# EAGLE design base_station (EAGLE 6.5.0)
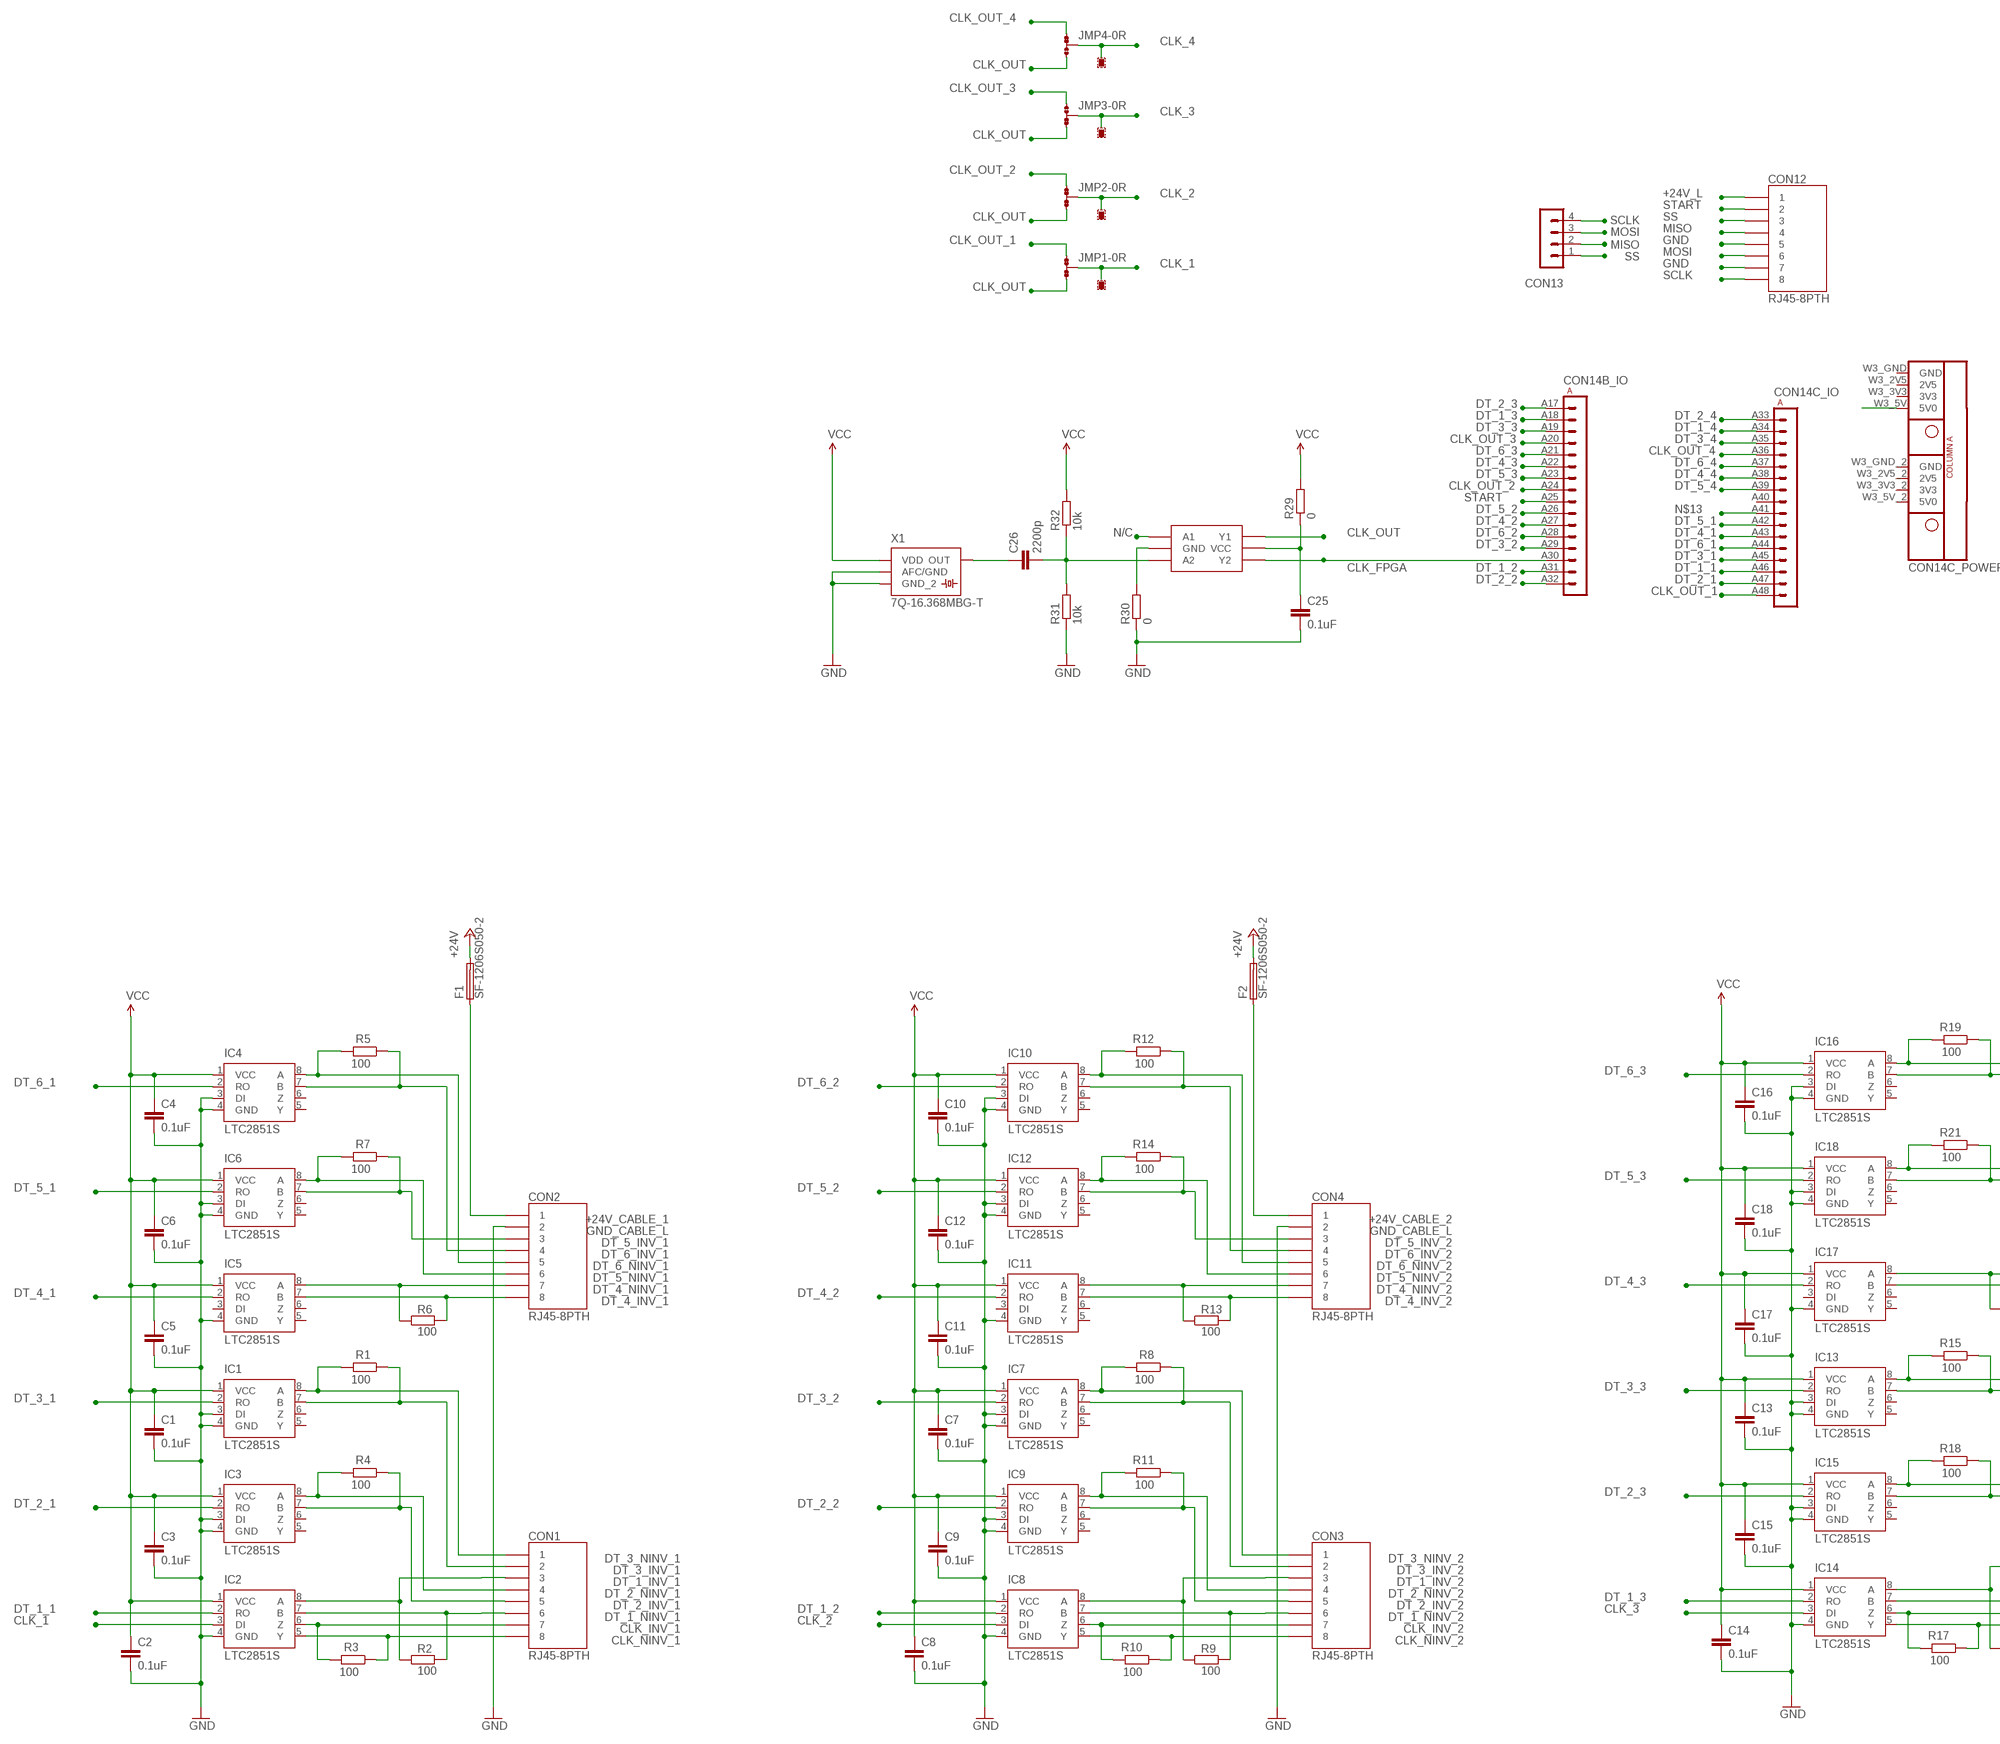
[diagram p0: schematic, sheet 1, part 1 of 2]
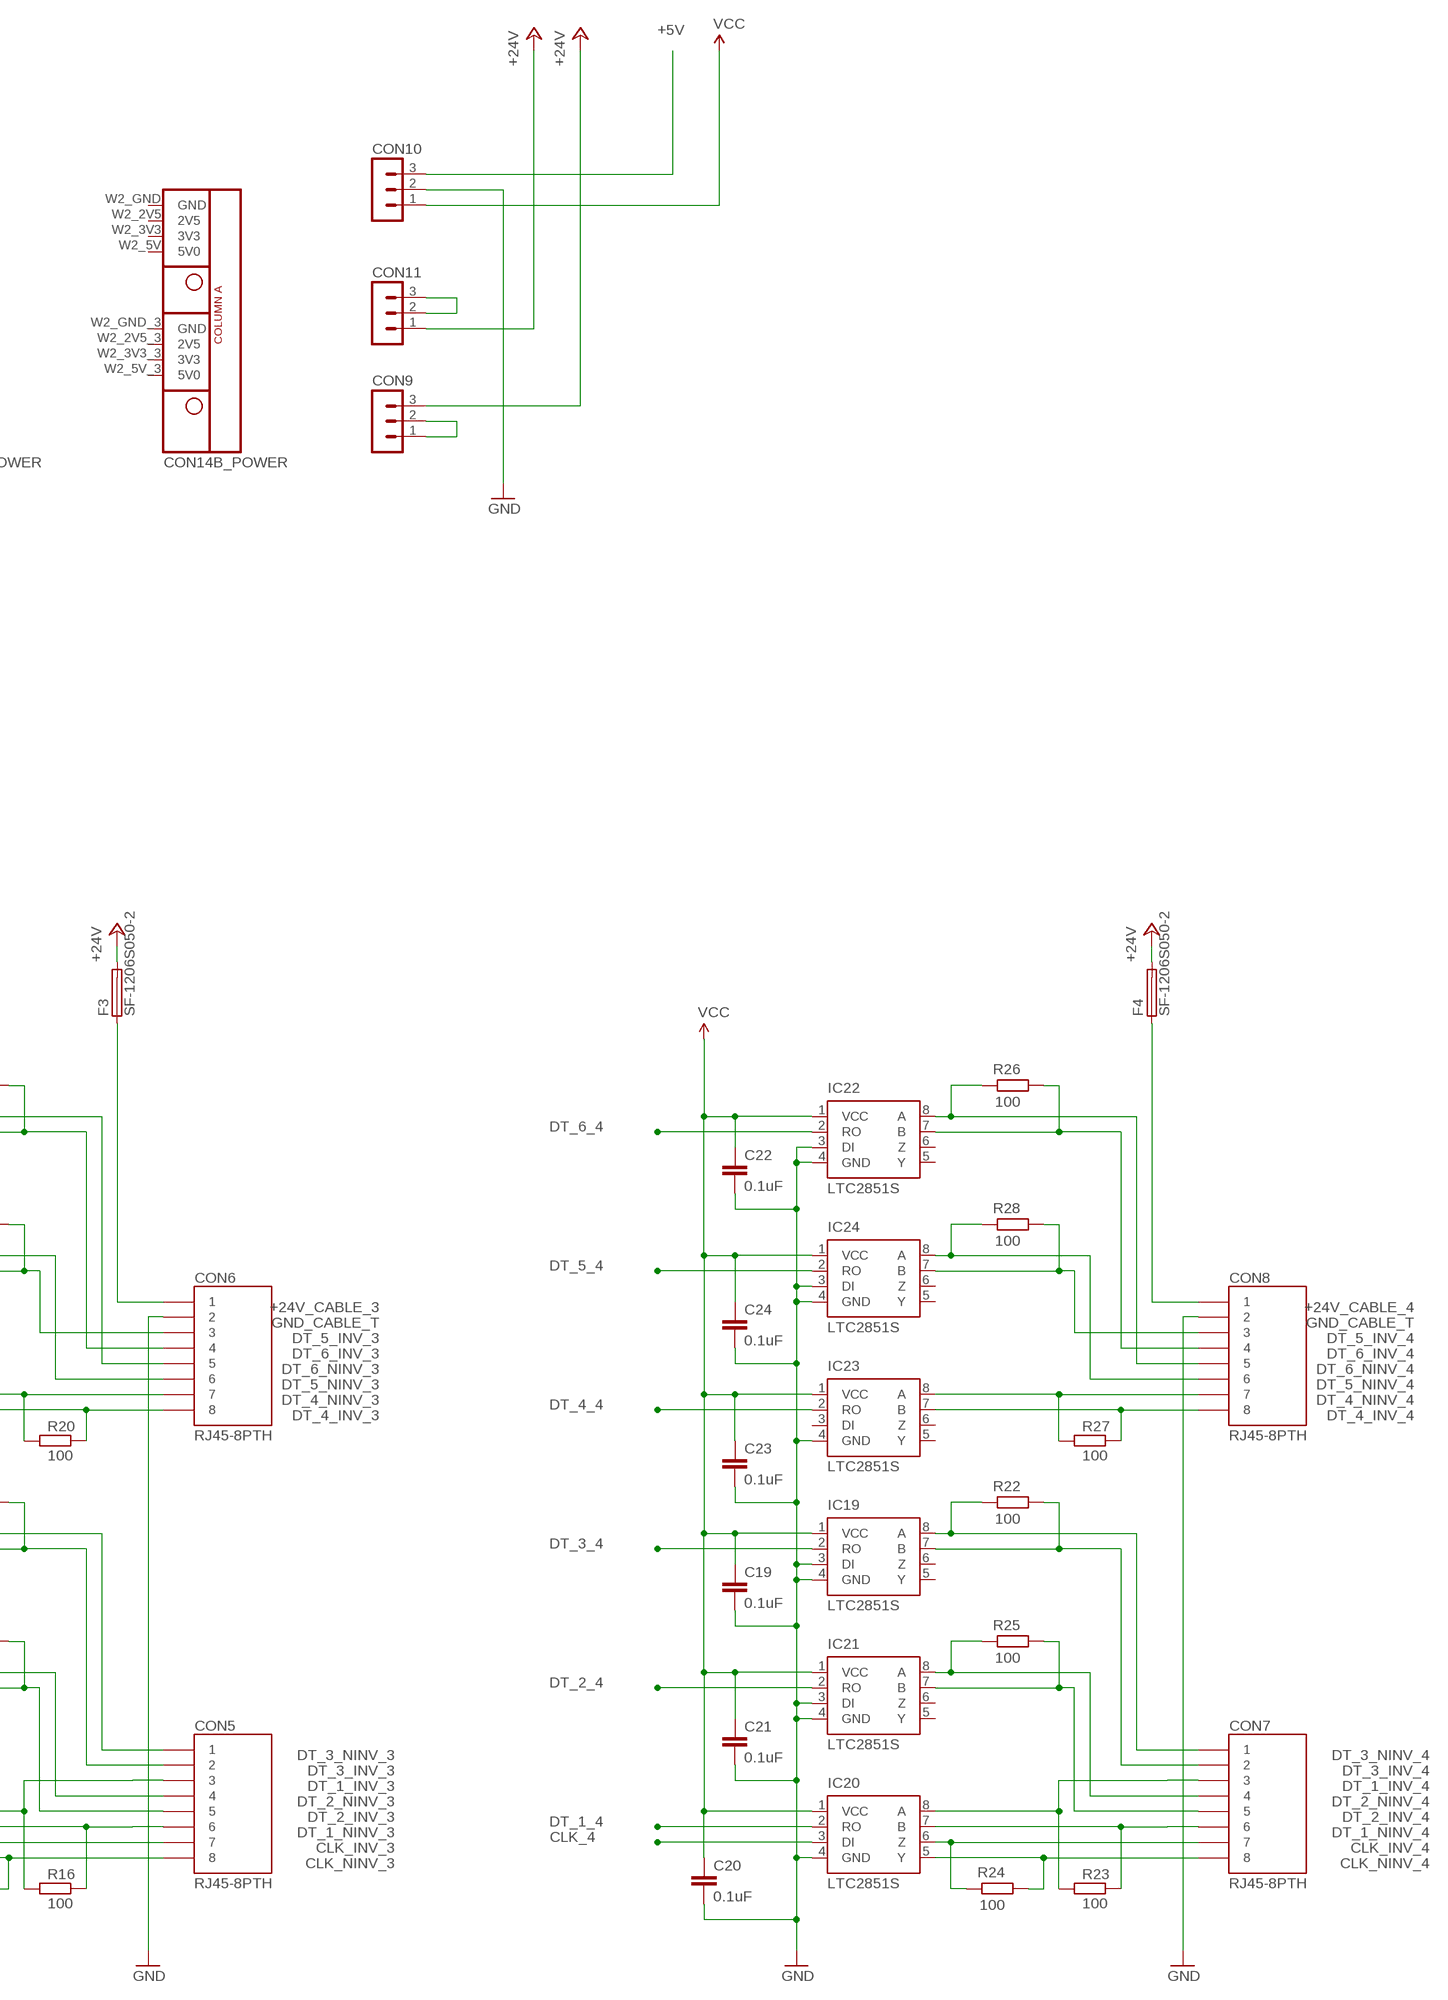
[diagram p1: schematic, sheet 1, part 2 of 2]

## Parts
C1  0.1uF  C-EUC0603  [C0603]
C2  0.1uF  C-EUC0603  [C0603]
C3  0.1uF  C-EUC0603  [C0603]
C4  0.1uF  C-EUC0603  [C0603]
C5  0.1uF  C-EUC0603  [C0603]
C6  0.1uF  C-EUC0603  [C0603]
C7  0.1uF  C-EUC0603  [C0603]
C8  0.1uF  C-EUC0603  [C0603]
C9  0.1uF  C-EUC0603  [C0603]
C10  0.1uF  C-EUC0603  [C0603]
C11  0.1uF  C-EUC0603  [C0603]
C12  0.1uF  C-EUC0603  [C0603]
C13  0.1uF  C-EUC0603  [C0603]
C14  0.1uF  C-EUC0603  [C0603]
C15  0.1uF  C-EUC0603  [C0603]
C16  0.1uF  C-EUC0603  [C0603]
C17  0.1uF  C-EUC0603  [C0603]
C18  0.1uF  C-EUC0603  [C0603]
C19  0.1uF  C-EUC0603  [C0603]
C20  0.1uF  C-EUC0603  [C0603]
C21  0.1uF  C-EUC0603  [C0603]
C22  0.1uF  C-EUC0603  [C0603]
C23  0.1uF  C-EUC0603  [C0603]
C24  0.1uF  C-EUC0603  [C0603]
C25  0.1uF  C-EUC0603  [C0603]
C26  2200p  C-EUC0603  [C0603]
CON1  RJ45-8PTH  [RJ45-8]
CON2  RJ45-8PTH  [RJ45-8]
CON3  RJ45-8PTH  [RJ45-8]
CON4  RJ45-8PTH  [RJ45-8]
CON5  RJ45-8PTH  [RJ45-8]
CON6  RJ45-8PTH  [RJ45-8]
CON7  RJ45-8PTH  [RJ45-8]
CON8  RJ45-8PTH  [RJ45-8]
CON9  MA03-1  [MA03-1]
CON10  MA03-1  [MA03-1]
CON11  MA03-1  [MA03-1]
CON12  RJ45-8PTH  [RJ45-8]
CON13  WING4  [WINGSIDE_4BIT]
CON14  MEGAWING_HALF_P1  [MEGAWING_HALF_NOHOLES_P1]
F1  SF-1206S050-2  [F1206]
F2  SF-1206S050-2  [F1206]
F3  SF-1206S050-2  [F1206]
F4  SF-1206S050-2  [F1206]
IC1  LTC2851S  [SOIC8]
IC2  LTC2851S  [SOIC8]
IC3  LTC2851S  [SOIC8]
IC4  LTC2851S  [SOIC8]
IC5  LTC2851S  [SOIC8]
IC6  LTC2851S  [SOIC8]
IC7  LTC2851S  [SOIC8]
IC8  LTC2851S  [SOIC8]
IC9  LTC2851S  [SOIC8]
IC10  LTC2851S  [SOIC8]
IC11  LTC2851S  [SOIC8]
IC12  LTC2851S  [SOIC8]
IC13  LTC2851S  [SOIC8]
IC14  LTC2851S  [SOIC8]
IC15  LTC2851S  [SOIC8]
IC16  LTC2851S  [SOIC8]
IC17  LTC2851S  [SOIC8]
IC18  LTC2851S  [SOIC8]
IC19  LTC2851S  [SOIC8]
IC20  LTC2851S  [SOIC8]
IC21  LTC2851S  [SOIC8]
IC22  LTC2851S  [SOIC8]
IC23  LTC2851S  [SOIC8]
IC24  LTC2851S  [SOIC8]
IC26  NC7WZ16P6X  [NC7WZ16P6X]
JMP1  0R-JUMPA  [A0R-JMP]
JMP2  0R-JUMPA  [A0R-JMP]
JMP3  0R-JUMPA  [A0R-JMP]
JMP4  0R-JUMPA  [A0R-JMP]
R1  100  R-EU_R0603  [R0603]
R2  100  R-EU_R0603  [R0603]
R3  100  R-EU_R0603  [R0603]
R4  100  R-EU_R0603  [R0603]
R5  100  R-EU_R0603  [R0603]
R6  100  R-EU_R0603  [R0603]
R7  100  R-EU_R0603  [R0603]
R8  100  R-EU_R0603  [R0603]
R9  100  R-EU_R0603  [R0603]
R10  100  R-EU_R0603  [R0603]
R11  100  R-EU_R0603  [R0603]
R12  100  R-EU_R0603  [R0603]
R13  100  R-EU_R0603  [R0603]
R14  100  R-EU_R0603  [R0603]
R15  100  R-EU_R0603  [R0603]
R16  100  R-EU_R0603  [R0603]
R17  100  R-EU_R0603  [R0603]
R18  100  R-EU_R0603  [R0603]
R19  100  R-EU_R0603  [R0603]
R20  100  R-EU_R0603  [R0603]
R21  100  R-EU_R0603  [R0603]
R22  100  R-EU_R0603  [R0603]
R23  100  R-EU_R0603  [R0603]
R24  100  R-EU_R0603  [R0603]
R25  100  R-EU_R0603  [R0603]
R26  100  R-EU_R0603  [R0603]
R27  100  R-EU_R0603  [R0603]
R28  100  R-EU_R0603  [R0603]
R29  0  R-EU_R0603  [R0603]
R30  0  R-EU_R0603  [R0603]
R31  10k  R-EU_R0603  [R0603]
R32  10k  R-EU_R0603  [R0603]
X1  7Q-16.368MBG-T  [4-SMD]

## Nets
+5V: CON10.3 CON14.W3_5V(C_POWER:5V0)
+24V_CABLE_1: CON2.1 F1.1
+24V_CABLE_2: CON4.1 F2.1
+24V_CABLE_3: CON6.1 F3.1
+24V_CABLE_4: CON8.1 F4.1
+24V_L: CON9.3 CON12.1 F1.2 F2.2 ; supply symbol labelled +24V
+24V_T: CON11.1 F3.2 F4.2 ; supply symbol labelled +24V
CLK_1: IC2.3(DI) JMP1.2
CLK_2: IC8.3(DI) JMP2.2
CLK_3: IC14.3(DI) JMP3.2
CLK_4: IC20.3(DI) JMP4.2
CLK_FPGA: CON14.A30(B_IO:A14) IC26.P$4(Y2)
CLK_INV_1: CON1.7 IC2.6(Z) R3.2
CLK_INV_2: CON3.7 IC8.6(Z) R10.2
CLK_INV_3: CON5.7 IC14.6(Z) R17.2
CLK_INV_4: CON7.7 IC20.6(Z) R24.2
CLK_NINV_1: CON1.8 IC2.5(Y) R3.1
CLK_NINV_2: CON3.8 IC8.5(Y) R10.1
CLK_NINV_3: CON5.8 IC14.5(Y) R17.1
CLK_NINV_4: CON7.8 IC20.5(Y) R24.1
CLK_OUT: IC26.P$6(Y1) JMP1.3 JMP2.3 JMP3.3 JMP4.3
CLK_OUT_1: CON14.A48(C_IO:A16) JMP1.1
CLK_OUT_2: CON14.A24(B_IO:A8) JMP2.1
CLK_OUT_3: CON14.A20(B_IO:A4) JMP3.1
CLK_OUT_4: CON14.A36(C_IO:A4) JMP4.1
DT_1_1: CON14.A46(C_IO:A14) IC2.2(RO)
DT_1_2: CON14.A31(B_IO:A15) IC8.2(RO)
DT_1_3: CON14.A18(B_IO:A2) IC14.2(RO)
DT_1_4: CON14.A34(C_IO:A2) IC20.2(RO)
DT_1_INV_1: CON1.3 IC2.8(A) R2.1
DT_1_INV_2: CON3.3 IC8.8(A) R9.1
DT_1_INV_3: CON5.3 IC14.8(A) R16.1
DT_1_INV_4: CON7.3 IC20.8(A) R23.1
DT_1_NINV_1: CON1.6 IC2.7(B) R2.2
DT_1_NINV_2: CON3.6 IC8.7(B) R9.2
DT_1_NINV_3: CON5.6 IC14.7(B) R16.2
DT_1_NINV_4: CON7.6 IC20.7(B) R23.2
DT_2_1: CON14.A47(C_IO:A15) IC3.2(RO)
DT_2_2: CON14.A32(B_IO:A16) IC9.2(RO)
DT_2_3: CON14.A17(B_IO:A1) IC15.2(RO)
DT_2_4: CON14.A33(C_IO:A1) IC21.2(RO)
DT_2_INV_1: CON1.5 IC3.7(B) R4.1
DT_2_INV_2: CON3.5 IC9.7(B) R11.1
DT_2_INV_3: CON5.5 IC15.7(B) R18.1
DT_2_INV_4: CON7.5 IC21.7(B) R25.1
DT_2_NINV_1: CON1.4 IC3.8(A) R4.2
DT_2_NINV_2: CON3.4 IC9.8(A) R11.2
DT_2_NINV_3: CON5.4 IC15.8(A) R18.2
DT_2_NINV_4: CON7.4 IC21.8(A) R25.2
DT_3_1: CON14.A45(C_IO:A13) IC1.2(RO)
DT_3_2: CON14.A29(B_IO:A13) IC7.2(RO)
DT_3_3: CON14.A19(B_IO:A3) IC13.2(RO)
DT_3_4: CON14.A35(C_IO:A3) IC19.2(RO)
DT_3_INV_1: CON1.2 IC1.7(B) R1.1
DT_3_INV_2: CON3.2 IC7.7(B) R8.1
DT_3_INV_3: CON5.2 IC13.7(B) R15.1
DT_3_INV_4: CON7.2 IC19.7(B) R22.1
DT_3_NINV_1: CON1.1 IC1.8(A) R1.2
DT_3_NINV_2: CON3.1 IC7.8(A) R8.2
DT_3_NINV_3: CON5.1 IC13.8(A) R15.2
DT_3_NINV_4: CON7.1 IC19.8(A) R22.2
DT_4_1: CON14.A43(C_IO:A11) IC5.2(RO)
DT_4_2: CON14.A27(B_IO:A11) IC11.2(RO)
DT_4_3: CON14.A22(B_IO:A6) IC17.2(RO)
DT_4_4: CON14.A38(C_IO:A6) IC23.2(RO)
DT_4_INV_1: CON2.8 IC5.7(B) R6.2
DT_4_INV_2: CON4.8 IC11.7(B) R13.2
DT_4_INV_3: CON6.8 IC17.7(B) R20.2
DT_4_INV_4: CON8.8 IC23.7(B) R27.2
DT_4_NINV_1: CON2.7 IC5.8(A) R6.1
DT_4_NINV_2: CON4.7 IC11.8(A) R13.1
DT_4_NINV_3: CON6.7 IC17.8(A) R20.1
DT_4_NINV_4: CON8.7 IC23.8(A) R27.1
DT_5_1: CON14.A42(C_IO:A10) IC6.2(RO)
DT_5_2: CON14.A26(B_IO:A10) IC12.2(RO)
DT_5_3: CON14.A23(B_IO:A7) IC18.2(RO)
DT_5_4: CON14.A39(C_IO:A7) IC24.2(RO)
DT_5_INV_1: CON2.3 IC6.7(B) R7.1
DT_5_INV_2: CON4.3 IC12.7(B) R14.1
DT_5_INV_3: CON6.3 IC18.7(B) R21.1
DT_5_INV_4: CON8.3 IC24.7(B) R28.1
DT_5_NINV_1: CON2.6 IC6.8(A) R7.2
DT_5_NINV_2: CON4.6 IC12.8(A) R14.2
DT_5_NINV_3: CON6.6 IC18.8(A) R21.2
DT_5_NINV_4: CON8.6 IC24.8(A) R28.2
DT_6_1: CON14.A44(C_IO:A12) IC4.2(RO)
DT_6_2: CON14.A28(B_IO:A12) IC10.2(RO)
DT_6_3: CON14.A21(B_IO:A5) IC16.2(RO)
DT_6_4: CON14.A37(C_IO:A5) IC22.2(RO)
DT_6_INV_1: CON2.4 IC4.7(B) R5.1
DT_6_INV_2: CON4.4 IC10.7(B) R12.1
DT_6_INV_3: CON6.4 IC16.7(B) R19.1
DT_6_INV_4: CON8.4 IC22.7(B) R26.1
DT_6_NINV_1: CON2.5 IC4.8(A) R5.2
DT_6_NINV_2: CON4.5 IC10.8(A) R12.2
DT_6_NINV_3: CON6.5 IC16.8(A) R19.2
DT_6_NINV_4: CON8.5 IC22.8(A) R26.2
GND: C1.2 C2.2 C3.2 C4.2 C5.2 C6.2 C7.2 C8.2 C9.2 C10.2 C11.2 C12.2 C13.2 C14.2 C15.2 C16.2 C17.2 C18.2 C19.2 C20.2 C21.2 C22.2 C23.2 C24.2 C25.2 CON10.2 CON12.5 CON12.7 IC1.3(DI) IC1.4(GND) IC2.4(GND) IC3.3(DI) IC3.4(GND) IC4.3(DI) IC4.4(GND) IC5.4(GND) IC6.3(DI) IC6.4(GND) IC7.3(DI) IC7.4(GND) IC8.4(GND) IC9.3(DI) IC9.4(GND) IC10.3(DI) IC10.4(GND) IC11.4(GND) IC12.3(DI) IC12.4(GND) IC13.3(DI) IC13.4(GND) IC14.4(GND) IC15.3(DI) IC15.4(GND) IC16.3(DI) IC16.4(GND) IC17.4(GND) IC18.3(DI) IC18.4(GND) IC19.3(DI) IC19.4(GND) IC20.4(GND) IC21.3(DI) IC21.4(GND) IC22.3(DI) IC22.4(GND) IC23.4(GND) IC24.3(DI) IC24.4(GND) R30.1 R31.1 X1.PAD_1(AFC/GND) X1.PAD_2(GND_2)
GND_CABLE_L: CON2.2 CON4.2 CON9.1 CON9.2 ; supply symbol labelled GND
GND_CABLE_T: CON6.2 CON8.2 CON11.2 CON11.3 ; supply symbol labelled GND
MISO: CON12.4 CON13.2(A2)
MOSI: CON12.6 CON13.3(A3)
N$4: IC26.P$2(GND) R30.2
N$5: C25.1 IC26.P$5(VCC) R29.1
N$6: C26.2 IC26.P$3(A2) R31.2 R32.1
N$9: C26.1 X1.PAD_3(OUT)
N$13: CON14.A41(C_IO:A9)
N/C: IC26.P$1(A1)
SCLK: CON12.8 CON13.4(A4)
SS: CON12.3 CON13.1(A1)
START: CON12.2 CON14.A25(B_IO:A9)
VCC: C1.1 C2.1 C3.1 C4.1 C5.1 C6.1 C7.1 C8.1 C9.1 C10.1 C11.1 C12.1 C13.1 C14.1 C15.1 C16.1 C17.1 C18.1 C19.1 C20.1 C21.1 C22.1 C23.1 C24.1 CON10.1 IC1.1(VCC) IC2.1(VCC) IC3.1(VCC) IC4.1(VCC) IC5.1(VCC) IC6.1(VCC) IC7.1(VCC) IC8.1(VCC) IC9.1(VCC) IC10.1(VCC) IC11.1(VCC) IC12.1(VCC) IC13.1(VCC) IC14.1(VCC) IC15.1(VCC) IC16.1(VCC) IC17.1(VCC) IC18.1(VCC) IC19.1(VCC) IC20.1(VCC) IC21.1(VCC) IC22.1(VCC) IC23.1(VCC) IC24.1(VCC) R29.2 R32.2 X1.PAD_4(VDD)
Unconnected: CON14.A40(C_IO:A8) CON14.W2_2V5(B_POWER:2V5) CON14.W2_2V5_3(B_POWER:2V5) CON14.W2_3V3(B_POWER:3V3) CON14.W2_3V3_3(B_POWER:3V3) CON14.W2_5V(B_POWER:5V0) CON14.W2_5V_3(B_POWER:5V0) CON14.W3_2V5(C_POWER:2V5) CON14.W3_2V5_2(C_POWER:2V5) CON14.W3_3V3(C_POWER:3V3) CON14.W3_3V3_2(C_POWER:3V3) CON14.W3_5V_2(C_POWER:5V0) IC1.5(Y) IC1.6(Z) IC3.5(Y) IC3.6(Z) IC4.5(Y) IC4.6(Z) IC5.3(DI) IC5.5(Y) IC5.6(Z) IC6.5(Y) IC6.6(Z) IC7.5(Y) IC7.6(Z) IC9.5(Y) IC9.6(Z) IC10.5(Y) IC10.6(Z) IC11.3(DI) IC11.5(Y) IC11.6(Z) IC12.5(Y) IC12.6(Z) IC13.5(Y) IC13.6(Z) IC15.5(Y) IC15.6(Z) IC16.5(Y) IC16.6(Z) IC17.3(DI) IC17.5(Y) IC17.6(Z) IC18.5(Y) IC18.6(Z) IC19.5(Y) IC19.6(Z) IC21.5(Y) IC21.6(Z) IC22.5(Y) IC22.6(Z) IC23.3(DI) IC23.5(Y) IC23.6(Z) IC24.5(Y) IC24.6(Z)

## Power pins joined to a net without a drawn wire
GND: CON14.W2_GND(B_POWER:GND) CON14.W2_GND_3(B_POWER:GND) CON14.W3_GND(C_POWER:GND) CON14.W3_GND_2(C_POWER:GND)

## Library data of the parts
C1-C26 = rcl:C-EU: CAPACITOR, European symbol
CON1-CON8 CON12 = SparkFun:RJ45-8: RJ45 Jack Simple RJ45, 8-pin connection - connector for common Cat5, Cat5e, and Cat6 Ethernet cables. Footprint not yet proven in production. Connector sku is PRT-00643; Breakout PCB sku is BOB-00716.
CON9-CON11 = con-lstb:MA03-1: PIN HEADER
CON13 = Papilio:WING4
CON14 = Papilio:MEGAWING_HALF_P1
F1-F4 = texas_lvds:SF-1206S050-2: FUSE SLOW 63VDC 500MA 1206 (Manufacturer Bourns Inc.)
IC1-IC24 = texas_lvds:LTC2851: 3.3V 20Mbps RS485/RS422 Transceiver - Full Duplex no Enable Source: http://cds.linear.com/docs/Datasheet/285012fd.pdf
IC26 = texas_lvds:NC7WZ16P6X: IC BUFFER DL UHS N-INV SC706
JMP1-JMP4 = jump-0r-smd:0R-JUMP: SMD 0R 0805 Jumper
R1-R32 = rcl:R-EU_: RESISTOR, European symbol
X1 = texas_lvds:7Q-16.368MBG-T

## Board
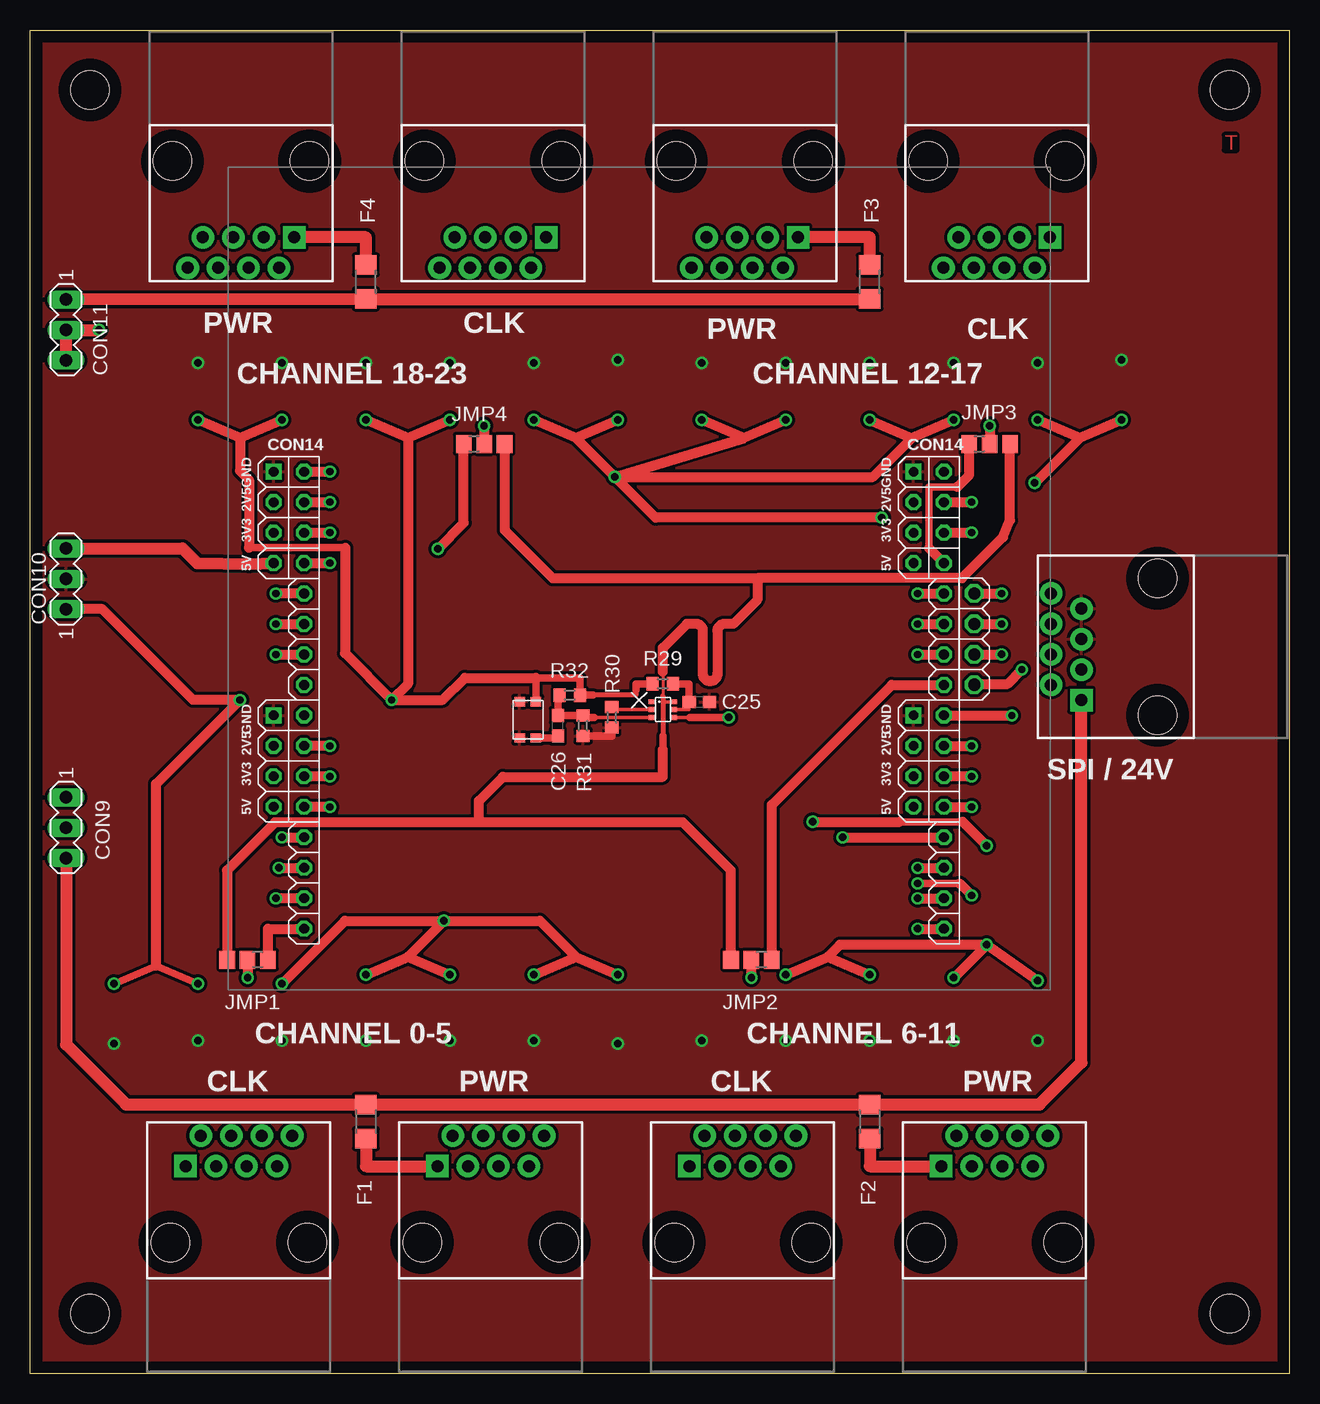
[diagram p2: board, top side]
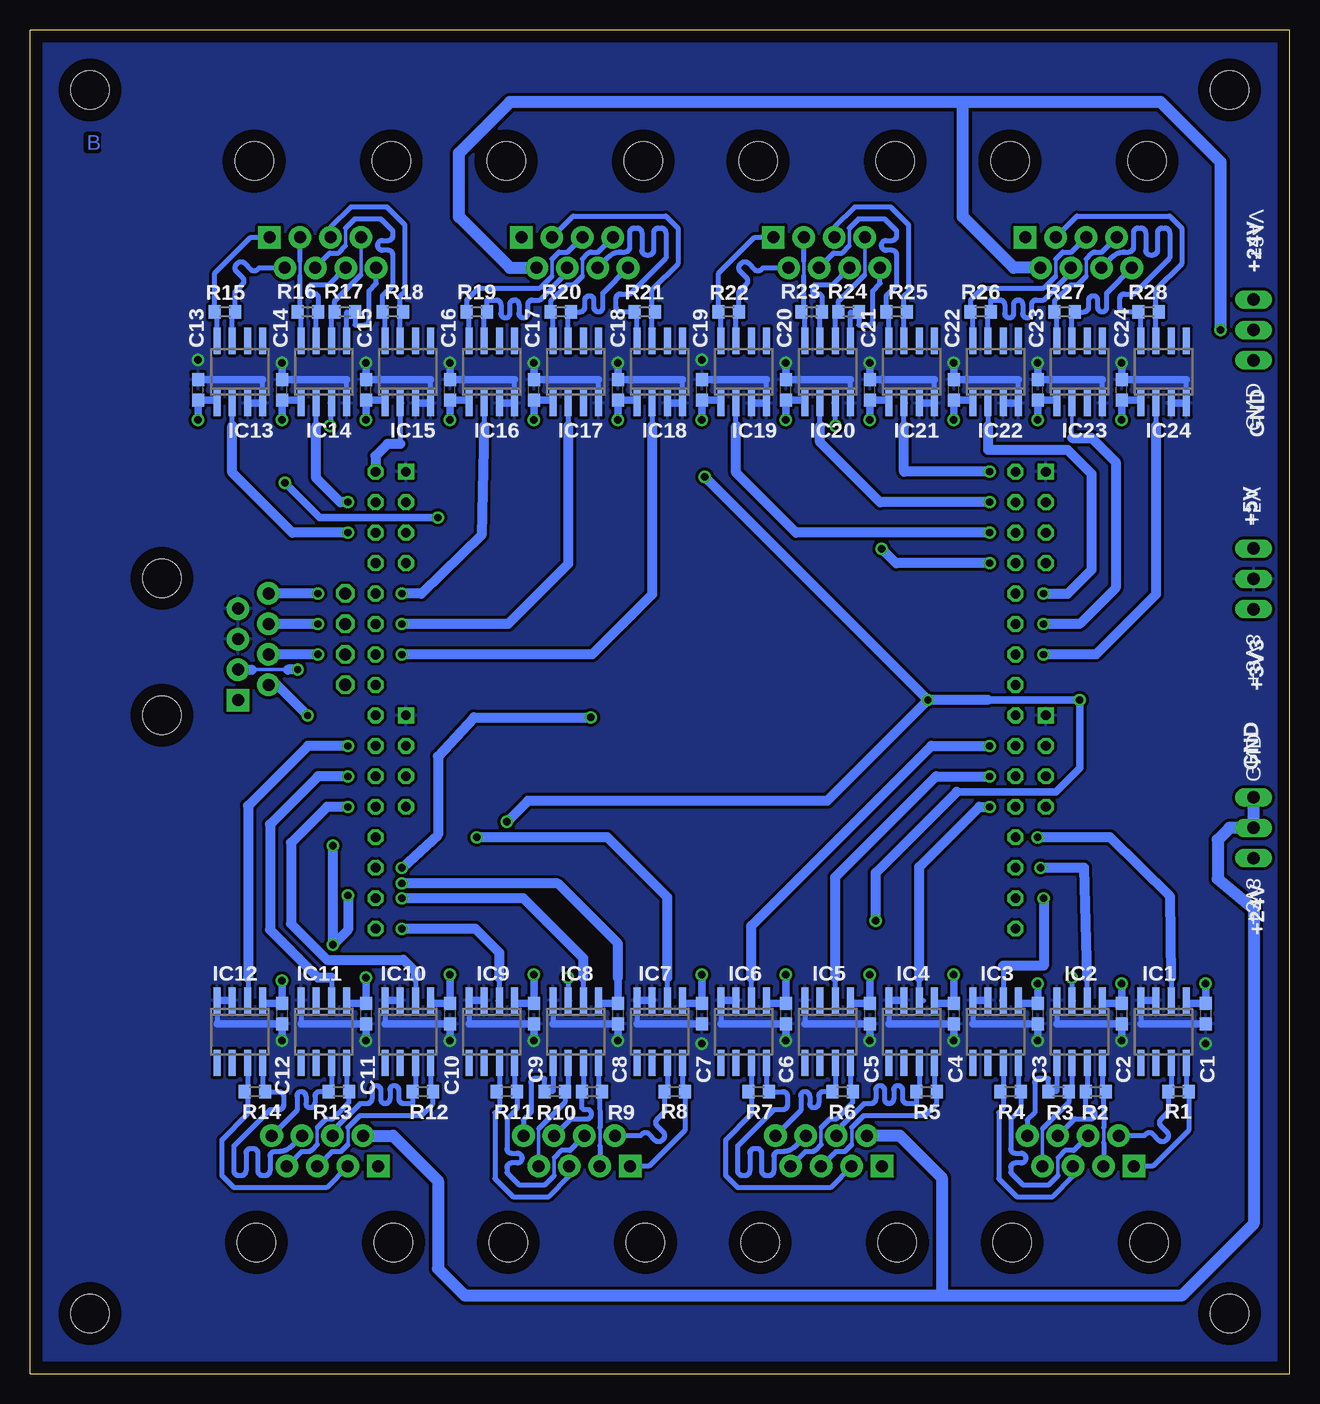
[diagram p3: board, bottom side, seen from below]

Size 105 x 112 mm. Coordinates in mm from the lower left corner, seen from the top.
Outline: 0,0 0,112 105,112 105,0 0,0
Copper layers (1*16): Top 0.035mm / dielectric 1.5mm / Bottom 0.035mm
Design rules "default": minimum track width 10mil, minimum drill 0.6mm, track to track 6mil, track to pad 6mil, pad to pad 6mil, via to via 6mil, smd to smd 6mil, copper to edge 40mil, drill to drill 8mil, minimum pad ring 10mil, minimum via ring 8mil, stop-mask expansion 4mil, vias tented up to drill 0.6mm, thermal gap 10mil
Holes 3.2 mm at 5,107 5,5 100,5 100,107

### Footprints (pad centres in the part's own frame; a part is rotated, then mirrored left to right if it is on the bottom)
C0603 = smd 1.1 x 1: 1 -0.85,0; 2 0.85,0
RJ45-8 = drill 1 pad 1.88 square: 1 -4.445,6.35 | drill 1 pad 1.88: 2 -3.175,8.89; 3 -1.905,6.35; 4 -0.635,8.89; 5 0.635,6.35; 6 1.905,8.89; 7 3.175,6.35; 8 4.445,8.89 | hole 3.2: -5.715,0; 5.715,0
MA03-1 = drill 1.016 long: 1 -2.54,0; 2 0,0; 3 2.54,0
WINGSIDE_4BIT = drill 1.016 octagon: 1 8.89,1.27; 2 6.35,1.27; 3 3.81,1.27; 4 1.27,1.27
MEGAWING_HALF_NOHOLES_P1 = drill 0.8 octagon: A17 59.69,43.18; A18 59.69,40.64; A19 59.69,38.1; A20 59.69,35.56; A21 59.69,33.02; A22 59.69,30.48; A23 59.69,27.94; A24 59.69,25.4; A25 59.69,22.86; A26 59.69,20.32; A27 59.69,17.78; A28 59.69,15.24; A29 59.69,12.7; A30 59.69,10.16; A31 59.69,7.62; A32 59.69,5.08; A33 6.35,43.18; A34 6.35,40.64; A35 6.35,38.1; A36 6.35,35.56; A37 6.35,33.02; A38 6.35,30.48; A39 6.35,27.94; A40 6.35,25.4; A41 6.35,22.86; A42 6.35,20.32; A43 6.35,17.78; A44 6.35,15.24; A45 6.35,12.7; A46 6.35,10.16; A47 6.35,7.62; A48 6.35,5.08; W2_2V5 57.15,40.64; W2_2V5_3 57.15,20.32; W2_3V3 57.15,38.1; W2_3V3_3 57.15,17.78; W2_5V 57.15,35.56; W2_5V_3 57.15,15.24; W3_2V5 3.81,40.64; W3_2V5_2 3.81,20.32; W3_3V3 3.81,38.1; W3_3V3_2 3.81,17.78; W3_5V 3.81,35.56; W3_5V_2 3.81,15.24 | drill 0.8 square: W2_GND 57.15,43.18; W2_GND_3 57.15,22.86; W3_GND 3.81,43.18; W3_GND_2 3.81,22.86
F1206 = smd 1.6 x 1.803: 1 -1.422,0; 2 1.422,0
SOIC8 = smd 0.6 x 2.2: 1 -1.905,-2.6; 2 -0.635,-2.6; 3 0.635,-2.6; 4 1.905,-2.6; 5 1.905,2.6; 6 0.635,2.6; 7 -0.635,2.6; 8 -1.905,2.6
NC7WZ16P6X = smd 0.4 x 0.5: P$1 -0.65,-0.95; P$2 0,-0.95; P$3 0.65,-0.95; P$4 0.65,0.95; P$5 0,0.95; P$6 -0.65,0.95
A0R-JMP = smd 1.5 x 1.3: 1 0,1.7; 2 0,0; 3 0,-1.7
R0603 = smd 1 x 1.1: 1 -0.85,0; 2 0.85,0
4-SMD = smd 0.78 x 0.87: PAD_1 -1.515,-0.68; PAD_2 1.515,-0.68; PAD_3 1.515,0.68; PAD_4 -1.515,0.68

### Placement (x,y rotation side)
C1  7,30 270 bottom
C2  14,30 270 bottom
C3  21,30 270 bottom
C4  28,30 270 bottom
C5  35,30 270 bottom
C6  42,30 270 bottom
C7  49,30 270 bottom
C8  56,30 270 bottom
C9  63,30 270 bottom
C10  70,30 270 bottom
C11  77,30 270 bottom
C12  84,30 270 bottom
C13  91,82 90 bottom
C14  84,82 90 bottom
C15  77,82 90 bottom
C16  70,82 90 bottom
C17  63,82 90 bottom
C18  56,82 90 bottom
C19  49,82 90 bottom
C20  42,82 90 bottom
C21  35,82 90 bottom
C22  28,82 90 bottom
C23  21,82 90 bottom
C24  14,82 90 bottom
C25  55.8,56 0 top
C26  44,54 90 top
CON1  17.41,10.93 0 top
CON2  38.41,10.93 0 top
CON3  59.41,10.93 0 top
CON4  80.41,10.93 0 top
CON5  80.59,101.07 180 top
CON6  59.59,101.07 180 top
CON7  38.59,101.07 180 top
CON8  17.59,101.07 180 top
CON9  3,45.5 270 top
CON10  3,66.25 90 top
CON11  3,87 270 top
CON12  94,60.59 90 top
CON13  77.45,66.3 270 top
CON14  16.5,32 0 top
F1  28,21 90 top
F2  70,21 90 top
F3  70,91 270 top
F4  28,91 270 top
IC1  10.5,28.5 180 bottom
IC2  17.5,28.5 180 bottom
IC3  24.5,28.5 180 bottom
IC4  31.5,28.5 180 bottom
IC5  38.5,28.5 180 bottom
IC6  45.5,28.5 180 bottom
IC7  52.5,28.5 180 bottom
IC8  59.5,28.5 180 bottom
IC9  66.5,28.5 180 bottom
IC10  73.5,28.5 180 bottom
IC11  80.5,28.5 180 bottom
IC12  87.5,28.5 180 bottom
IC13  87.5,83.5 0 bottom
IC14  80.5,83.5 0 bottom
IC15  73.5,83.5 0 bottom
IC16  66.5,83.5 0 bottom
IC17  59.5,83.5 0 bottom
IC18  52.5,83.5 0 bottom
IC19  45.5,83.5 0 bottom
IC20  38.5,83.5 0 bottom
IC21  31.5,83.5 0 bottom
IC22  24.5,83.5 0 bottom
IC23  17.5,83.5 0 bottom
IC24  10.5,83.5 0 bottom
IC26  52.75,55.35 270 top
JMP1  18.14,34.5 270 top
JMP2  60.13,34.5 270 top
JMP3  80,77.5 90 top
JMP4  37.87,77.5 90 top
R1  9.25,23.5 0 bottom
R2  16.15,23.5 180 bottom
R3  19.25,23.5 0 bottom
R4  23.25,23.5 0 bottom
R5  30.25,23.5 0 bottom
R6  37.25,23.5 180 bottom
R7  44.25,23.5 0 bottom
R8  51.25,23.5 0 bottom
R9  58.15,23.5 180 bottom
R10  61.25,23.5 0 bottom
R11  65.25,23.5 0 bottom
R12  72.25,23.5 0 bottom
R13  79.25,23.5 180 bottom
R14  86.25,23.5 0 bottom
R15  88.75,88.5 180 bottom
R16  81.85,88.5 0 bottom
R17  78.75,88.5 180 bottom
R18  74.75,88.5 180 bottom
R19  67.75,88.5 180 bottom
R20  60.75,88.5 0 bottom
R21  53.75,88.5 180 bottom
R22  46.75,88.5 180 bottom
R23  39.85,88.5 0 bottom
R24  36.75,88.5 180 bottom
R25  32.75,88.5 180 bottom
R26  25.75,88.5 180 bottom
R27  18.75,88.5 0 bottom
R28  11.75,88.5 180 bottom
R29  52.75,57.5 180 top
R30  48.5,54.7 90 top
R31  46.1,54 90 top
R32  45,56.55 0 top
X1  41.5,54.5 270 top

### Tracks (layer width: path | path; a pad name or v marks a point on that pad's centre or on a via)
+5V
  Top 1.016: CON10.3 12.71,68.79 13.94,67.56 18.25,67.5 CON14.W3_5V
+24V_CABLE_1
  Top 1.016: F1.1 28,17.28 CON2.1
+24V_CABLE_2
  Top 1.016: F2.1 70,17.28 CON4.1
+24V_CABLE_3
  Top 1.016: F3.1 70,94.72 CON6.1
+24V_CABLE_4
  Top 1.016: F4.1 28,94.72 CON8.1
+24V_L
  Top 1.016: CON9.3 3,27.42 8,22.42 F1.2 F2.2 84.15,22.42 87.65,25.92 CON12.1
+24V_T
  Top 1.016: F3.2 F4.2 CON11.1
CLK_1  (via drill 0.6)
  Top 0.813: JMP1.2 v18.14,33
  Bottom 0.406: 18,31.1 IC2.3 v18.14,33
CLK_2  (via drill 0.6)
  Top 0.813: v60.13,33 JMP2.2
  Bottom 0.406: 60,31.1 IC8.3 v60.13,33
CLK_3  (via drill 0.6)
  Top 0.813: v80,79 JMP3.2
  Bottom 0.406: 80,80.9 IC14.3 v80,79
CLK_4  (via drill 0.6)
  Top 0.813: v37.87,79 JMP4.2
  Bottom 0.406: 38,80.9 IC20.3 v37.87,79
CLK_FPGA  (via drill 0.6)
  Top 0.305: 55,54.7 IC26.P$4
  Top 0.61: v58.25,54.7 55,54.7
  Top 0.813: v74,42.16 CON14.A30
  Bottom 0.813: v74,42.16 71,44.91 71,51.45 68,54.7 v58.25,54.7
CLK_INV_1
  Bottom 0.305: 20.59,20.41 CON1.7
  Bottom 0.406: IC2.6 18.14,23.5 R3.2 18.4,22.6 20.59,20.41
CLK_INV_2
  Bottom 0.305: 62.59,20.41 CON3.7
  Bottom 0.406: IC8.6 60.13,23.5 R10.2 60.4,22.6 62.59,20.41
CLK_INV_3
  Bottom 0.305: 77.42,91.58 CON5.7
  Bottom 0.406: IC14.6 79.86,88.5 R17.2 79.6,89.4 77.42,91.58
CLK_INV_4
  Bottom 0.305: 35.41,91.58 CON7.7
  Bottom 0.406: IC20.6 37.87,88.5 R24.2 37.6,89.4 35.41,91.58
CLK_NINV_1
  Bottom 0.406: IC2.5 19.41,23.5 R3.1 20.1,24.6 20.9,24.6 arc-90 21.25,24.25 21.25,21.75 21.86,21.14 CON1.8
CLK_NINV_2
  Bottom 0.406: IC8.5 61.41,23.5 R10.1 62.1,24.6 62.9,24.6 arc-90 63.25,24.25 63.25,21.75 63.85,21.14 CON3.8
CLK_NINV_3
  Bottom 0.406: IC14.5 78.59,88.5 R17.1 77.9,87.4 77.1,87.4 arc-90 76.75,87.75 76.75,90.25 76.14,90.86 CON5.8
CLK_NINV_4
  Bottom 0.406: IC20.5 36.59,88.5 R24.1 35.9,87.4 35.1,87.4 arc-90 34.75,87.75 34.75,90.25 34.15,90.86 CON7.8
CLK_OUT
  Top 0.254: 52.75,58.5 52.75,56.5
  Top 0.305: IC26.P$6 52.75,56
  Top 0.406: 52.75,56.5 52.75,56 52.75,53.15
  Top 0.61: 52.75,53.15 52.75,52
  Top 0.813: JMP4.3 39.56,70.3 43.56,66.3 60.63,66.3 | 60.63,66.3 77.7,66.3 81.11,69.71 81.7,71.13 JMP3.3 | JMP2.3 58.44,41.95 54.44,45.95 37.44,45.95 | 37.44,45.95 20.43,45.95 16.43,41.95 JMP1.3 | 37.44,45.95 37.44,47.75 39.44,49.75 52.75,49.75 52.75,52 | 52.75,58.5 52.75,60.5 54.75,62.5 55.5,62.5 arc-90 56.1,61.9 56.1,58.32 arc90 56.69,57.72 56.71,57.72 arc90 57.31,58.32 57.31,61.9 arc-90 57.91,62.5 58.63,62.5 60.63,64.5 60.63,66.3
CLK_OUT_1
  Top 0.813: JMP1.1 19.84,37.08 CON14.A48
CLK_OUT_2
  Top 0.813: JMP2.1 61.84,47.4 71.83,57.4 CON14.A24
CLK_OUT_3
  Top 0.61: 77.3,73.9 74.95,73.9 74.95,68.8
  Top 0.813: 77.3,73.9 78.3,74.9 JMP3.1 | CON14.A20 74.95,68.8
CLK_OUT_4  (via drill 0.6)
  Top 0.813: CON14.A36 v25,67.56 | JMP4.1 36.16,70.91 v34,68.75
  Bottom 0.813: v25,67.56 32.81,67.56 v34,68.75
DT_1_1  (via drill 0.6)
  Top 0.813: v20.75,42.16 CON14.A46
  Bottom 0.406: IC2.2 16.86,33
  Bottom 0.813: 16.86,33 17.11,42.16 v20.75,42.16
DT_1_2  (via drill 0.6)
  Top 0.813: v74,39.62 CON14.A31
  Bottom 0.406: IC8.2 58.87,33
  Bottom 0.813: 58.87,33 58.87,34.62 63.87,39.62 v74,39.62
DT_1_3  (via drill 0.6)
  Top 0.813: CON14.A18 v78.5,72.64
  Bottom 0.406: 81.14,79 IC14.2
  Bottom 0.813: v78.5,72.64 79.14,72.64 81.14,74.64 81.14,79
DT_1_4  (via drill 0.6)
  Top 0.813: CON14.A34 v25,72.64
  Bottom 0.406: 39.13,79 IC20.2
  Bottom 0.813: v25,72.64 34.13,72.64 39.13,77.64 39.13,79
DT_1_INV_1
  Bottom 0.305: 15.5,20.5 15.5,19.25
  Bottom 0.406: 15.5,20.5 15.51,23.5 R2.1 15.45,23.5 arc90 15.6,23.65 IC2.8 | 15.5,19.25 CON1.3
DT_1_INV_2
  Bottom 0.305: 57.5,20.5 57.5,19
  Bottom 0.406: 57.5,20.5 57.51,23.5 R9.1 57.45,23.5 arc90 57.59,23.65 IC8.8 | 57.5,19 CON3.3
DT_1_INV_3
  Bottom 0.305: 82.5,91.5 82.5,92.75
  Bottom 0.406: 82.5,91.5 82.5,88.5 R16.1 82.56,88.5 arc90 82.41,88.35 IC14.8 | 82.5,92.75 CON5.3
DT_1_INV_4
  Bottom 0.305: 40.5,91.5 40.5,92.75
  Bottom 0.406: 40.5,91.5 40.49,88.5 R23.1 40.55,88.5 arc90 40.41,88.35 IC20.8 | 40.5,92.75 CON7.3
DT_1_NINV_1
  Bottom 0.406: CON1.6 17.89,21.25 16.45,21.25 arc-90 16.25,21.45 16.25,21.8 arc-90 16.45,22 16.8,22 arc90 17,22.2 R2.2 arc-90 16.86,23.63 IC2.7
DT_1_NINV_2
  Bottom 0.406: CON3.6 59.88,21.25 58.45,21.25 arc-90 58.25,21.45 58.25,21.8 arc-90 58.45,22 58.8,22 arc90 59,22.2 R9.2 arc-90 58.87,23.63 IC8.7
DT_1_NINV_3
  Bottom 0.406: CON5.6 80.11,90.75 81.55,90.75 arc-90 81.75,90.55 81.75,90.2 arc-90 81.55,90 81.2,90 arc90 81,89.8 R16.2 arc-90 81.14,88.36 IC14.7
DT_1_NINV_4
  Bottom 0.406: CON7.6 38.12,90.75 39.55,90.75 arc-90 39.75,90.55 39.75,90.2 arc-90 39.55,90 39.2,90 arc90 39,89.8 R23.2 arc-90 39.13,88.36 IC20.7
DT_2_1  (via drill 0.6)
  Top 0.813: CON14.A47 v20.5,39.62
  Bottom 0.406: 24,31.1 IC3.2 23.86,34
  Bottom 0.813: v20.5,39.62 20.5,34 23.86,34
DT_2_2  (via drill 0.6)
  Top 0.813: v74,37.08 CON14.A32
  Bottom 0.406: 66,31.1 IC9.2 65.86,33
  Bottom 0.813: 65.86,33 65.86,35.08 67.86,37.08 v74,37.08
DT_2_3
  Bottom 0.406: 74,80.9 IC15.2 74.14,77.5
  Bottom 0.813: 74.14,77.5 75.19,77.5 76.19,76.5 CON14.A17
DT_2_4  (via drill 0.6)
  Top 0.813: CON14.A33 v25,75.18
  Bottom 0.406: 32,80.9 IC21.2 32.13,79
  Bottom 0.813: v25,75.18 32.13,75.18 32.13,79
DT_2_INV_1
  Bottom 0.406: IC3.7 23.86,23.5 | 23.86,23.5 R4.1 | 23.86,23.5 23.86,22.13 24.25,21.75 24.25,16.25 22.75,14.75 19.75,14.75 18.05,16.45 CON1.5
DT_2_INV_2
  Bottom 0.406: IC9.7 65.86,23.5 | 65.86,23.5 R11.1 | 65.86,23.5 65.86,22.13 66.25,21.75 66.25,16.25 64.75,14.75 61.75,14.75 60.05,16.45 CON3.5
DT_2_INV_3
  Bottom 0.406: IC15.7 74.14,88.5 | 74.14,88.5 R18.1 | 74.14,88.5 74.14,89.86 73.75,90.25 73.75,95.75 75.25,97.25 78.25,97.25 79.95,95.55 CON5.5
DT_2_INV_4
  Bottom 0.406: IC21.7 32.13,88.5 | 32.13,88.5 R25.1 | 32.13,88.5 32.13,89.86 31.75,90.25 31.75,95.75 33.25,97.25 36.25,97.25 37.95,95.55 CON7.5
DT_2_NINV_1
  Bottom 0.305: 19.31,18 19.31,16.5
  Bottom 0.406: IC3.8 22.59,23.5 R4.2 22.4,22.1 23.25,21.25 23.25,18.76 arc-90 22.86,18.37 22.38,18.37 arc90 21.99,17.98 21.99,17.94 arc90 22.38,17.54 22.86,17.54 arc-90 23.25,17.15 23.25,16.75 22.25,15.75 20.06,15.75 19.31,16.5 | CON1.4 18,18.6 18.71,18.6 19.31,18
DT_2_NINV_2
  Bottom 0.305: 61.31,18 61.31,16.5
  Bottom 0.406: IC9.8 64.59,23.5 R11.2 64.4,22.1 65.25,21.25 65.25,18.76 arc-90 64.86,18.37 64.38,18.37 arc90 63.99,17.98 63.99,17.94 arc90 64.38,17.54 64.86,17.54 arc-90 65.25,17.15 65.25,16.75 64.25,15.75 62.06,15.75 61.31,16.5 | CON3.4 59.99,18.6 60.71,18.6 61.31,18
DT_2_NINV_3
  Bottom 0.305: 78.69,94 78.69,95.5
  Bottom 0.406: IC15.8 75.41,88.5 R18.2 75.6,89.9 74.75,90.75 74.75,93.24 arc-90 75.14,93.63 75.62,93.63 arc90 76.01,94.03 76.01,94.06 arc90 75.62,94.46 75.14,94.46 arc-90 74.75,94.85 74.75,95.25 75.75,96.25 77.94,96.25 78.69,95.5 | CON5.4 80,93.4 79.29,93.4 78.69,94
DT_2_NINV_4
  Bottom 0.305: 36.69,94 36.69,95.5
  Bottom 0.406: IC21.8 33.41,88.5 R25.2 33.6,89.9 32.75,90.75 32.75,93.24 arc-90 33.14,93.63 33.62,93.63 arc90 34.01,94.03 34.01,94.06 arc90 33.62,94.46 33.14,94.46 arc-90 32.75,94.85 32.75,95.25 33.75,96.25 35.94,96.25 36.69,95.5 | CON7.4 38.01,93.4 37.29,93.4 36.69,94
DT_3_1  (via drill 0.6)
  Top 0.813: v21,44.7 CON14.A45
  Bottom 0.406: 9.87,33 IC1.2
  Bottom 0.813: 9.87,33 9.94,39.76 14.94,44.7 v21,44.7
DT_3_2  (via drill 0.6)
  Top 0.813: v67.75,44.7 CON14.A29
  Bottom 0.406: IC7.2 51.87,33
  Bottom 0.813: 51.87,33 51.87,39.7 56.87,44.7 v67.75,44.7
DT_3_3  (via drill 0.6)
  Top 0.813: CON14.A19 v78.5,70.1
  Bottom 0.406: 88.14,79 IC13.2
  Bottom 0.813: v78.5,70.1 83.14,70.1 88.14,75.1 88.14,79
DT_3_4  (via drill 0.6)
  Top 0.813: CON14.A35 v25,70.1
  Bottom 0.406: 46.13,79 IC19.2
  Bottom 0.813: v25,70.1 41.13,70.1 46.13,75.1 46.13,79
DT_3_INV_1
  Bottom 0.406: IC1.7 9.87,23.5 R1.1 10.1,21.82 10.72,21.2 arc-90 10.72,20.64 10.2,20.11 arc90 10.2,19.56 10.32,19.43 arc90 10.88,19.43 11.4,19.96 arc-90 11.96,19.96 12.1,19.82 CON1.2
DT_3_INV_2
  Bottom 0.406: IC7.7 51.87,23.5 R8.1 52.1,21.82 52.73,21.2 arc-90 52.73,20.64 52.2,20.11 arc90 52.2,19.56 52.32,19.43 arc90 52.88,19.43 53.4,19.96 arc-90 53.96,19.96 54.1,19.82 CON3.2
DT_3_INV_3
  Bottom 0.406: IC13.7 88.14,88.5 R15.1 87.9,90.18 87.28,90.81 arc-90 87.28,91.36 87.8,91.89 arc90 87.8,92.44 87.68,92.56 arc90 87.12,92.56 86.6,92.04 arc-90 86.04,92.04 85.9,92.18 CON5.2
DT_3_INV_4
  Bottom 0.406: IC19.7 46.13,88.5 R22.1 45.9,90.18 45.27,90.81 arc-90 45.27,91.36 45.8,91.89 arc90 45.8,92.44 45.68,92.56 arc90 45.12,92.56 44.6,92.04 arc-90 44.04,92.04 43.9,92.18 CON7.2
DT_3_NINV_1
  Bottom 0.406: IC1.8 8.6,23.5 R1.2 8.4,20.28 11.4,17.28 CON1.1
DT_3_NINV_2
  Bottom 0.406: IC7.8 50.59,23.5 R8.2 50.4,20.28 53.4,17.28 CON3.1
DT_3_NINV_3
  Bottom 0.406: IC13.8 89.41,88.5 R15.2 89.6,91.72 86.6,94.72 CON5.1
DT_3_NINV_4
  Bottom 0.406: IC19.8 47.41,88.5 R22.2 47.6,91.72 44.6,94.72 CON7.1
DT_4_1  (via drill 0.6)
  Top 0.813: v25,49.78 CON14.A43
  Bottom 0.406: IC5.2 37.87,33
  Bottom 0.813: 37.87,33 37.87,41.39 29.47,49.78 v25,49.78
DT_4_2  (via drill 0.6)
  Top 0.813: v78.5,49.78 CON14.A27
  Bottom 0.406: 79.86,33 IC11.2
  Bottom 0.813: 79.86,33 81,33 85,37 85,45.78 81,49.78 v78.5,49.78
DT_4_3  (via drill 0.6)
  Top 0.813: v74,62.48 CON14.A22
  Bottom 0.406: IC17.2 60.13,79
  Bottom 0.813: 60.13,79 60.13,67.5 65.14,62.5 v74,62.48
DT_4_4  (via drill 0.6)
  Top 0.813: v20.5,62.48 CON14.A38
  Bottom 0.305: IC23.2 18.14,78
  Bottom 0.813: 18.14,78 16.5,78 14.5,76 14.5,65.48 17.5,62.48 v20.5,62.48
DT_4_INV_1
  Bottom 0.406: IC5.7 37.87,23.5 R6.2 38.86,23.5 arc-90 39.25,23.11 39.25,22.54 arc90 39.64,22.15 arc90 40,22.51 40,23.11 arc-90 40.39,23.5 arc-90 40.75,23.14 40.75,21.93 CON2.8
DT_4_INV_2
  Bottom 0.406: IC11.7 79.86,23.5 R13.2 80.86,23.5 arc-90 81.25,23.11 81.25,22.54 arc90 81.64,22.15 arc90 82,22.51 82,23.11 arc-90 82.39,23.5 arc-90 82.75,23.14 82.75,21.93 CON4.8
DT_4_INV_3
  Bottom 0.406: IC17.7 60.13,88.5 R20.2 59.14,88.5 arc-90 58.75,88.89 58.75,89.46 arc90 58.36,89.85 arc90 58,89.49 58,88.89 arc-90 57.61,88.5 arc-90 57.25,88.86 57.25,90.08 CON6.8
DT_4_INV_4
  Bottom 0.406: IC23.7 18.14,88.5 R27.2 17.14,88.5 arc-90 16.75,88.89 16.75,89.46 arc90 16.36,89.85 arc90 16,89.49 16,88.89 arc-90 15.61,88.5 arc-90 15.25,88.86 15.25,90.08 CON8.8
DT_4_NINV_1
  Bottom 0.305: 39.05,20.5 39.05,19.1
  Bottom 0.406: IC5.8 36.59,23.5 R6.1 36.4,22.6 37.75,21.25 38.3,21.25 39.05,20.5 | 39.05,19.1 39.53,18.62 arc45 39.81,18.5 40.37,18.5 CON2.7
DT_4_NINV_2
  Bottom 0.305: 81.05,20.5 81.05,19.1
  Bottom 0.406: IC11.8 78.59,23.5 R13.1 78.4,22.6 79.75,21.25 80.3,21.25 81.05,20.5 | 81.05,19.1 81.53,18.62 arc45 81.81,18.5 82.36,18.5 CON4.7
DT_4_NINV_3
  Bottom 0.305: 58.95,91.5 58.95,92.9
  Bottom 0.406: IC17.8 61.41,88.5 R20.1 61.6,89.4 60.25,90.75 59.7,90.75 58.95,91.5 | 58.95,92.9 58.47,93.39 arc45 58.19,93.5 57.63,93.5 CON6.7
DT_4_NINV_4
  Bottom 0.305: 16.95,91.5 16.95,92.9
  Bottom 0.406: IC23.8 19.41,88.5 R27.1 19.6,89.4 18.25,90.75 17.7,90.75 16.95,91.5 | 16.95,92.9 16.47,93.39 arc45 16.19,93.5 15.63,93.5 CON8.7
DT_5_1  (via drill 0.6)
  Top 0.813: v25,52.32 CON14.A42
  Bottom 0.406: IC6.2 44.87,33
  Bottom 0.813: 44.87,33 44.87,37.32 29.86,52.32 v25,52.32
DT_5_2  (via drill 0.6)
  Top 0.813: CON14.A26 v78.5,52.32
  Bottom 0.406: 86.83,33 IC12.2
  Bottom 0.813: v78.5,52.32 81.83,52.32 86.83,47.32 86.83,33
DT_5_3  (via drill 0.6)
  Top 0.813: v74,59.94 CON14.A23
  Bottom 0.406: IC18.2 53.13,79
  Bottom 0.813: 53.13,79 53.13,64.94 58.13,59.94 v74,59.94
DT_5_4  (via drill 0.6)
  Top 0.813: v20.5,59.94 CON14.A39
  Bottom 0.406: IC24.2 11.13,79
  Bottom 0.813: 11.13,79 11.13,64.94 16.14,59.94 v20.5,59.94
DT_5_INV_1
  Bottom 0.406: IC6.7 44.87,23.5 | 44.87,23.5 R7.1 | 44.87,23.5 44.87,21.63 47,19.5 47,16.5 46,15.5 38.28,15.5 CON2.3
DT_5_INV_2
  Bottom 0.406: IC12.7 86.86,23.5 | 86.86,23.5 R14.1 | 86.86,23.5 86.86,21.63 89,19.5 89,16.5 88,15.5 80.28,15.5 CON4.3
DT_5_INV_3
  Bottom 0.406: IC18.7 53.13,88.5 | 53.13,88.5 R21.1 | 53.13,88.5 53.13,90.36 51,92.5 51,95.5 52,96.5 59.72,96.5 CON6.3
DT_5_INV_4
  Bottom 0.406: IC24.7 11.13,88.5 | 11.13,88.5 R28.1 | 11.13,88.5 11.13,90.36 9,92.5 9,95.5 10,96.5 17.71,96.5 CON8.3
DT_5_NINV_1
  Bottom 0.406: IC6.8 43.59,23.5 R7.2 42.24,23.5 arc90 41.85,23.11 41.85,22.39 arc90 42.24,22 43,22 46,19 46,16.89 arc-90 45.61,16.5 45.39,16.5 arc-90 45,16.89 45,18.36 arc90 44.61,18.75 44.39,18.75 arc90 44,18.36 44,16.89 arc-90 43.61,16.5 43.39,16.5 arc-90 43,16.89 43,18.11 arc90 42.61,18.5 42.26,18.5 arc-45 41.2,18.94 CON2.6
DT_5_NINV_2
  Bottom 0.406: IC12.8 85.59,23.5 R14.2 84.24,23.5 arc90 83.85,23.11 83.85,22.39 arc90 84.24,22 85,22 88,19 88,16.89 arc-90 87.61,16.5 87.39,16.5 arc-90 87,16.89 87,18.36 arc90 86.61,18.75 86.39,18.75 arc90 86,18.36 86,16.89 arc-90 85.61,16.5 85.39,16.5 arc-90 85,16.89 85,18.11 arc90 84.61,18.5 84.26,18.5 arc-45 83.2,18.94 CON4.6
DT_5_NINV_3
  Bottom 0.406: IC18.8 54.41,88.5 R21.2 55.76,88.5 arc90 56.15,88.89 56.15,89.61 arc90 55.76,90 55,90 52,93 52,95.11 arc-90 52.39,95.5 52.61,95.5 arc-90 53,95.11 53,93.64 arc90 53.39,93.25 53.61,93.25 arc90 54,93.64 54,95.11 arc-90 54.39,95.5 54.61,95.5 arc-90 55,95.11 55,93.89 arc90 55.39,93.5 55.74,93.5 arc-45 56.8,93.06 CON6.6
DT_5_NINV_4
  Bottom 0.406: IC24.8 12.4,88.5 R28.2 13.76,88.5 arc90 14.15,88.89 14.15,89.61 arc90 13.76,90 13,90 10,93 10,95.11 arc-90 10.39,95.5 10.61,95.5 arc-90 11,95.11 11,93.64 arc90 11.39,93.25 11.61,93.25 arc90 12,93.64 12,95.11 arc-90 12.39,95.5 12.61,95.5 arc-90 13,95.11 13,93.89 arc90 13.39,93.5 13.74,93.5 arc-45 14.8,93.06 CON8.6
DT_6_1  (via drill 0.6)
  Top 0.813: v25,47.24 CON14.A44
  Bottom 0.406: 30.5,31.1 IC4.2 30.86,33
  Bottom 0.813: 30.86,33 30.86,42.24 25.86,47.24 v25,47.24
DT_6_2  (via drill 0.6)
  Top 0.813: CON14.A28 v78.5,47.24
  Bottom 0.406: 72.86,33 IC10.2
  Bottom 0.813: v78.5,47.24 80.25,47.24 83.25,44.24 83.25,37.5 80.25,34.5 73.86,34.5 72.86,33.5 72.86,33
DT_6_3  (via drill 0.6)
  Top 0.813: v74,65.02 CON14.A21
  Bottom 0.406: IC16.2 67.14,79
  Bottom 0.813: 67.14,79 67.37,69.89 72.37,65.02 v74,65.02
DT_6_4  (via drill 0.6)
  Top 0.813: CON14.A37 v20.5,65.02
  Bottom 0.406: IC22.2 25.14,79
  Bottom 0.813: 25.14,79 25.14,77 18.5,77 16.5,75 16.5,67.02 18.5,65.02 v20.5,65.02
DT_6_INV_1
  Bottom 0.406: IC4.7 30.86,23.5 R5.1 31.1,22.5 31.86,22.5 arc90 32.25,22.89 32.25,23.61 arc-90 32.64,24 arc-90 33,23.64 33,22.89 arc90 33.39,22.5 arc90 33.75,22.86 33.75,23.61 arc-90 34.14,24 arc-90 34.5,23.64 34.5,22.89 arc90 34.89,22.5 35.5,22.5 37.77,20.23 CON2.4
DT_6_INV_2
  Bottom 0.406: IC10.7 72.86,23.5 R12.1 73.1,22.5 73.86,22.5 arc90 74.25,22.89 74.25,23.61 arc-90 74.64,24 arc-90 75,23.64 75,22.89 arc90 75.39,22.5 arc90 75.75,22.86 75.75,23.61 arc-90 76.14,24 arc-90 76.5,23.64 76.5,22.89 arc90 76.89,22.5 77.5,22.5 79.78,20.23 CON4.4
DT_6_INV_3
  Bottom 0.406: IC16.7 67.14,88.5 R19.1 66.9,89.5 66.14,89.5 arc90 65.75,89.11 65.75,88.39 arc-90 65.36,88 arc-90 65,88.36 65,89.11 arc90 64.61,89.5 arc90 64.25,89.14 64.25,88.39 arc-90 63.86,88 arc-90 63.5,88.36 63.5,89.11 arc90 63.11,89.5 62.5,89.5 60.23,91.78 CON6.4
DT_6_INV_4
  Bottom 0.406: IC22.7 25.14,88.5 R26.1 24.9,89.5 24.14,89.5 arc90 23.75,89.11 23.75,88.39 arc-90 23.36,88 arc-90 23,88.36 23,89.11 arc90 22.61,89.5 arc90 22.25,89.14 22.25,88.39 arc-90 21.86,88 arc-90 21.5,88.36 21.5,89.11 arc90 21.11,89.5 20.5,89.5 18.23,91.78 CON8.4
DT_6_NINV_1
  Bottom 0.305: 36.5,20.5 36.5,19.1
  Bottom 0.406: IC4.8 29.59,23.5 R5.2 29.4,22.5 30.4,21.5 35.51,21.5 36.51,20.5 36.5,20.5 | 36.5,19.1 37.1,18.5 37.83,18.5 CON2.5
DT_6_NINV_2
  Bottom 0.305: 78.5,20.5 78.5,19.1
  Bottom 0.406: IC10.8 71.59,23.5 R12.2 71.4,22.5 72.4,21.5 77.5,21.5 78.5,20.5 | 78.5,19.1 79.1,18.5 79.83,18.5 CON4.5
DT_6_NINV_3
  Bottom 0.305: 61.5,91.5 61.5,92.9
  Bottom 0.406: IC16.8 68.41,88.5 R19.2 68.6,89.5 67.6,90.5 62.49,90.5 61.49,91.5 61.5,91.5 | 61.5,92.9 60.9,93.5 60.17,93.5 CON6.5
DT_6_NINV_4
  Bottom 0.305: 19.5,91.5 19.5,92.9
  Bottom 0.406: IC22.8 26.41,88.5 R26.2 26.6,89.5 25.6,90.5 20.5,90.5 19.5,91.5 | 19.5,92.9 18.9,93.5 18.18,93.5 CON8.5
GND  (via drill 0.6)
  Top 0.61: R31.1 48.5,53.15 R30.1
  Bottom 0.406: IC2.4 19.41,29.15 | IC3.4 26.41,29.15 | IC4.4 33.41,29.15 | IC5.4 40.41,29.15 | IC6.4 47.41,29.15 | IC1.4 12.4,29.15 | IC8.4 61.41,29.15 | IC9.4 68.41,29.15 | IC10.4 75.41,29.15 | IC11.4 82.41,29.15 | IC12.4 89.41,29.15 | IC7.4 54.41,29.15 | IC14.4 78.59,82.85 | IC15.4 71.59,82.85 | IC16.4 64.59,82.85 | IC17.4 57.59,82.85 | IC18.4 50.59,82.85 | IC13.4 85.59,82.85 | IC20.4 36.59,82.85 | IC21.4 29.59,82.85 | IC22.4 22.59,82.85 | IC23.4 15.6,82.85 | IC24.4 8.6,82.85 | IC19.4 43.59,82.85
  Bottom 0.61: 19.41,29.15 C2.2 v14,27.75 | 26.41,29.15 C3.2 v21,27.75 | 33.41,29.15 C4.2 v28,27.75 | 40.41,29.15 C5.2 v35,27.75 | 47.41,29.15 C6.2 v42,27.75 | IC6.4 IC6.3 | IC4.4 IC4.3 | IC3.4 IC3.3 | IC1.4 IC1.3 | 12.4,29.15 C1.2 | 61.41,29.15 C8.2 v56,27.75 | 68.41,29.15 C9.2 v63,27.75 | 75.41,29.15 C10.2 v70,27.75 | 82.41,29.15 C11.2 v77,27.75 | 89.41,29.15 C12.2 v84,27.75 | IC12.4 IC12.3 | IC10.4 IC10.3 | IC9.4 IC9.3 | IC7.4 IC7.3 | 54.41,29.15 C7.2 | 78.59,82.85 C14.2 v84,84.25 | 71.59,82.85 C15.2 v77,84.25 | 64.59,82.85 C16.2 v70,84.25 | 57.59,82.85 C17.2 v63,84.25 | 50.59,82.85 C18.2 v56,84.25 | IC18.4 IC18.3 | IC16.4 IC16.3 | IC15.4 IC15.3 | IC13.4 IC13.3 | 85.59,82.85 C13.2 | 36.59,82.85 C20.2 v42,84.25 | 29.59,82.85 C21.2 v35,84.25 | 22.59,82.85 C22.2 v28,84.25 | 15.6,82.85 C23.2 v21,84.25 | 8.6,82.85 C24.2 v14,84.25 | IC24.4 IC24.3 | IC22.4 IC22.3 | IC21.4 IC21.3 | IC19.4 IC19.3 | 43.59,82.85 C19.2
  other vias: 7,27.5 49,27.5 91,84.5 49,84.5
  pour Bottom (isolate 0.254): -4,-9 112,-9.5 112,120 -4,122
  pour Top (isolate 0.254): -2,-4 108.5,-3.5 108.5,119.5 -2,119
GND_CABLE_L
  Bottom 1.016: CON9.1 CON9.2 5,45.5 6,44.5 6,41.25 3,38.75 3,12.5 9,6.5 29,6.5 | 29,6.5 29,16.32 32.5,19.82 CON2.2 | 29,6.5 68.75,6.5 71,8.75 71,16.07 74.75,19.82 CON4.2
GND_CABLE_T  (via drill 0.6)
  Top 1.016: CON11.3 CON11.2 v5.75,87
  Bottom 1.016: 27.25,106 27.25,96.43 23,92.18 CON8.2 | v5.75,87 5.75,101 10.75,106 27.25,106 | 27.25,106 65,106 69.25,101.75 69.25,96.43 65,92.18 CON6.2
MISO  (via drill 0.6)
  Top 0.813: CON13.2 v81,59.95
  Bottom 0.813: v81,59.95 CON12.4
MOSI  (via drill 0.6)
  Top 0.813: CON13.3 v81,62.49
  Bottom 0.813: v81,62.49 CON12.6
N$4
  Top 0.305: IC26.P$2 48.5,55.35 R30.2
N$5
  Top 0.305: IC26.P$5 54.95,55.35 C25.1
  Top 0.61: C25.1 54.95,57.5 R29.1
N$6
  Top 0.305: 47,54.7 IC26.P$3
  Top 0.61: R32.1 44,56.5 C26.2 R31.2 46,54.7 47,54.7
N$9
  Top 0.61: X1.PAD_3 44,52.98 C26.1
SCLK  (via drill 0.6)
  Top 0.813: CON13.4 v81,65.03
  Bottom 0.813: v81,65.03 CON12.8
SS  (via drill 0.6)
  Top 0.813: CON13.1 78.81,57.5 81.5,57.5 v82.68,58.68
  Bottom 0.305: 86.5,58.68 83.5,58.68
  Bottom 0.813: CON12.3 86.5,58.68 | v82.68,58.68 83.5,58.68
START  (via drill 0.6)
  Top 0.813: CON14.A25 v81.86,54.86
  Bottom 0.813: v81.86,54.86 84.41,57.41 CON12.2
VCC  (via drill 0.6)
  Top 0.406: 50.5,57 50.5,56.55 46.95,56.55
  Top 0.61: R29.2 50.5,57.5 50.5,57 | 46.95,56.55 R32.2 45.85,58 42.18,58 X1.PAD_4 | v74,40.85 77.5,40.85 | v7,32.5 10.5,34 v14,32.5 | 18.25,68.84 26.29,68.84 | 72.5,46 77.75,46
  Top 0.813: 42.18,58 36.25,58 34.4,56.15 v30.15,56.15 | v91,79.5 87.5,78 | 87.5,78 v84,79.5 | v77,79.5 73.5,78 | v63,79.5 59.5,78 | 59.5,78 v56,79.5 | v49,79.5 45.5,78 | 45.5,78 v42,79.5 | v35,79.5 31.5,78 | 31.5,78 v28,79.5 | v21,79.5 17.5,78 | 17.5,78 v14,79.5 | 77.5,40.85 v78.5,39.85 | v79.75,44 77.75,46 | v79.75,35.75 v77,33 | v28,33.25 31.5,34.75 | 31.5,34.75 v35,33.25 | v42,33.25 45.5,34.75 | 45.5,34.75 v49,33.25 | 31.5,34.75 v34.5,37.75 | v84,32.75 v79.75,35.75 | v63,33.25 66.5,34.75 | 66.5,34.75 v70,33.25 | v79.75,35.75 67.5,35.75 66.5,34.75 | 45.5,78 v48.75,74.75 | v48.75,74.75 59.5,78 | v71,71.35 52.15,71.35 v48.75,74.75 | v21,32.5 26.25,37.75 v34.5,37.75 | v34.5,37.75 42.5,37.75 45.5,34.75 | 31.5,78 31.5,57.5 v30.15,56.15 | 10.5,34 10.5,49.15 v17.5,56.15 13.6,56.15 6.04,63.71 CON10.1 | v30.15,56.15 26.25,60.05 26.29,66.84 26.29,68.84 | 17.5,78 17.5,75.25 18.25,74.5 18.25,68.84 | v65.25,46 72.5,46 | 87.5,78 v83.75,74.25 | v70,79.5 73.5,78 | v48.75,74.75 70.25,74.75 73.5,78
  Bottom 0.61: IC1.1 8.6,30.85 C1.1 v7,32.5 | IC2.1 15.6,30.85 C2.1 v14,32.5 | IC3.1 22.59,30.85 C3.1 v21,32.5 | IC4.1 29.59,30.85 C4.1 v28,33.25 | IC5.1 36.59,30.85 C5.1 v35,33.25 | IC6.1 43.59,30.85 C6.1 v42,33.25 | IC7.1 50.59,30.85 C7.1 v49,33.25 | IC8.1 57.59,30.85 C8.1 56,33 | IC9.1 64.59,30.85 C9.1 v63,33.25 | IC10.1 71.59,30.85 C10.1 v70,33.25 | IC11.1 78.59,30.85 C11.1 v77,33 | IC12.1 85.59,30.85 C12.1 v84,32.75 | v91,79.5 C13.1 89.41,81.15 IC13.1 | v84,79.5 C14.1 82.41,81.15 IC14.1 | v77,79.5 C15.1 75.41,81.15 IC15.1 | v70,79.5 C16.1 68.41,81.15 IC16.1 | IC17.1 61.41,81.15 C17.1 v63,79.5 | IC18.1 54.41,81.15 C18.1 v56,79.5 | v49,79.5 C19.1 47.41,81.15 IC19.1 | v42,79.5 C20.1 40.41,81.15 IC20.1 | v35,79.5 C21.1 33.41,81.15 IC21.1 | v28,79.5 C22.1 26.41,81.15 IC22.1 | IC23.1 19.41,81.15 C23.1 v21,79.5 | IC24.1 12.4,81.15 C24.1 v14,79.5 | v71,71.35 80.85,71.35 v83.75,74.25 | v17.5,56.15 17.45,56.15 | v17.5,56.15 25.15,56.15 | 27.75,48.5 19.5,48.5 17.5,50.5 v17.5,56.15
  Bottom 0.813: 56,33 56,35.85 61,40.85 v74,40.85 | v78.5,39.85 78.5,37 v79.75,35.75 v79.75,44 | v34.5,37.75 34.5,41.75 27.75,48.5 | v30.15,56.15 v48.75,74.75 | 25.15,56.15 v30.15,56.15 | v30.15,56.15 38.55,47.75 63.5,47.75 v65.25,46

### Text on the board
Top: T
Bottom: B
tNames: PWR | CLK | PWR | CLK | CHANNEL 18-23 | CHANNEL 12-17 | SPI / 24V | CHANNEL 0-5 | CHANNEL 6-11 | CLK | PWR | CLK | PWR
bNames: +24V | GND | +5V | +3V3 | GND | +3v3
_tsilk: F4 | F3 | PWR | CLK | PWR | CLK | CHANNEL 18-23 | CHANNEL 12-17 | JMP4 | JMP3 | R29 | R32 | R30 | X1 | C25 | IC26 | SPI / 24V | C26 | R31 | JMP1 | JMP2 | CHANNEL 0-5 | CHANNEL 6-11 | CLK | PWR | CLK | PWR | F1 | F2
_bsilk: +24V | R28 | R26 | R25 | R24 | R22 | R21 | R19 | R18 | R17 | R15 | R27 | R23 | R20 | R16 | C24 | C18 | C23 | C22 | C21 | C20 | C19 | C17 | C16 | C15 | C14 | C13 | GND | IC24 | IC23 | IC22 | IC21 | IC20 | IC19 | IC18 | IC17 | IC16 | IC15 | IC14 | IC13 | +5V | +3V3 | GND | +24V | IC1 | IC2 | IC3 | IC4 | IC5 | IC6 | IC7 | IC8 | IC9 | IC10 | IC11 | IC12 | C1 | C2 | C3 | C4 | C5 | C7 | C8 | C9 | C10 | C11 | C6 | C12 | R2 | R6 | R9 | R13 | R1 | R3 | R4 | R5 | R7 | R8 | R10 | R11 | R12 | R14